# EAGLE design netzteil (EAGLE 9.2.2)
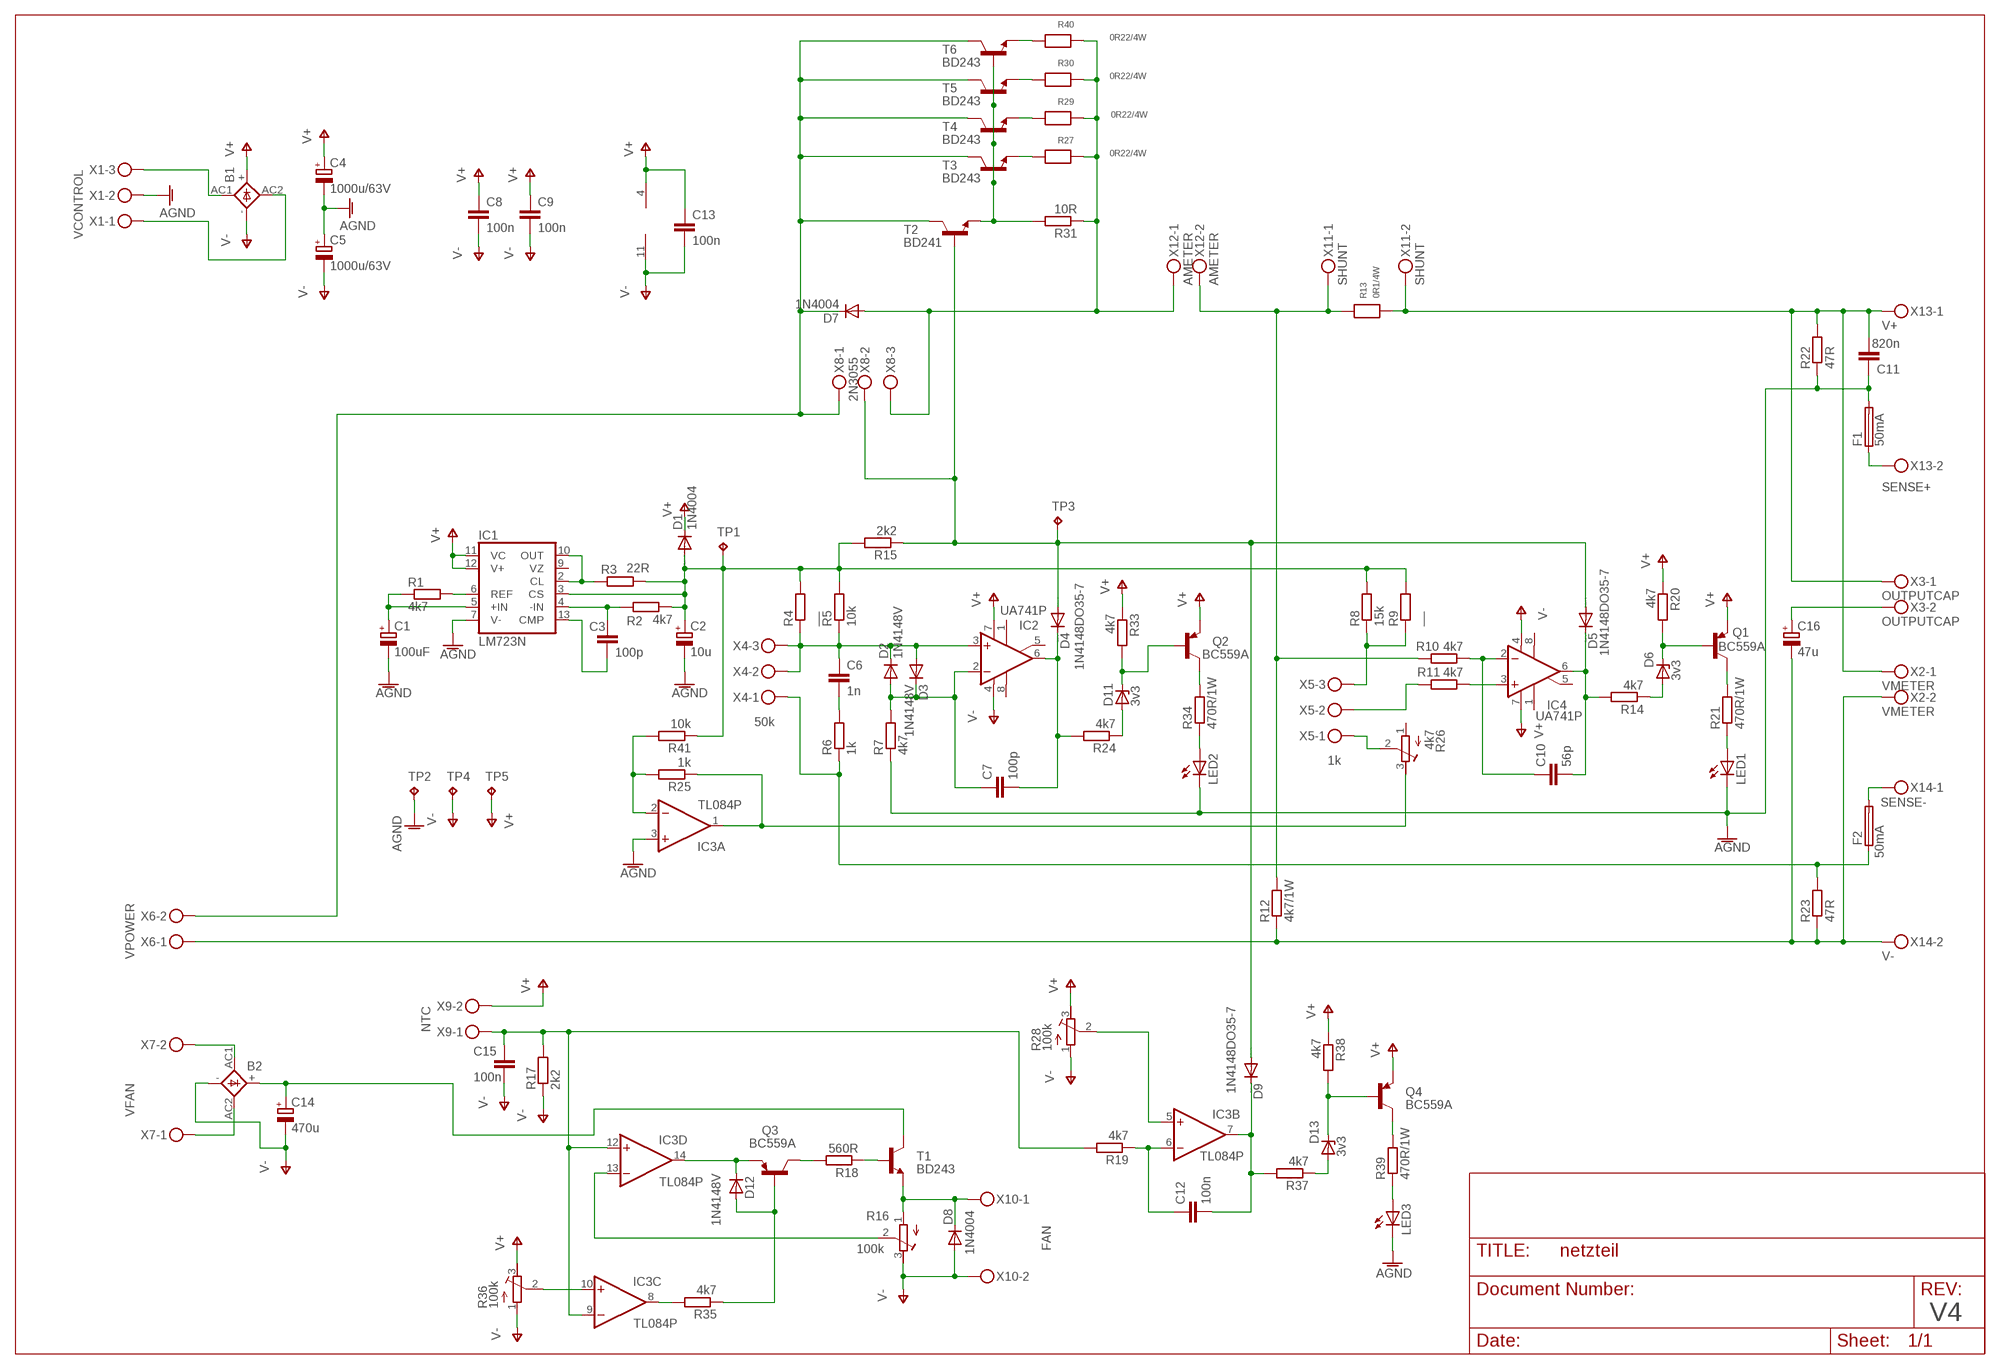
[diagram p0: schematic, sheet 1]

## Parts
B1  1KAB  [1KAB]
B2  1KAB  [1KAB]
C1  100uF  CPOL-EUE3.5-8  [E3,5-8]
C2  10u  CPOL-EUE3.5-8  [E3,5-8]
C3  100p  C-EU025-025X050  [C025-025X050]
C4  1000u/63V  CPOL-EUE7.5-18  [E7,5-18]
C5  1000u/63V  CPOL-EUE7.5-18  [E7,5-18]
C6  1n  C-EU025-025X050  [C025-025X050]
C7  100p  C-EU025-025X050  [C025-025X050]
C8  100n  C-EU025-025X050  [C025-025X050]
C9  100n  C-EU025-025X050  [C025-025X050]
C10  56p  C-EU025-025X050  [C025-025X050]
C11  820n  C-EU025-025X050  [C025-025X050]
C12  100n  C-EU025-025X050  [C025-025X050]
C13  100n  C-EU025-025X050  [C025-025X050]
C14  470u  CPOL-EUE5-13  [E5-13]
C15  100n  C-EU025-025X050  [C025-025X050]
C16  47u  CPOL-EUE3.5-8  [E3,5-8]
D1  1N4004  [DO41-10]
D2  1N4148V  [SHORTDIODE]
D3  1N4148V  [SHORTDIODE]
D4  1N4148DO35-7  [DO35-7]
D5  1N4148DO35-7  [DO35-7]
D6  3v3  ZENER-DIODE  [SHORTDIODE]
D7  1N4004  [DO41-10]
D8  1N4004  [DO41-10]
D9  1N4148DO35-7  [DO35-7]
D11  3v3  ZENER-DIODE  [SHORTDIODE]
D12  1N4148V  [SHORTDIODE]
D13  3v3  ZENER-DIODE  [SHORTDIODE]
F1  50mA  FUSEPICOFUSE  [PICOFUSE]
F2  50mA  FUSEPICOFUSE  [PICOFUSE]
IC1  LM723N  [DIL14]
IC2  UA741P  [DIL08]
IC3  TL084P  [DIL14]
IC4  UA741P  [DIL08]
LED1  LED3MM  [LED3MM]
LED2  LED3MM  [LED3MM]
LED3  LED3MM  [LED3MM]
Q1  BC559A  [TO92-EBC]
Q2  BC559A  [TO92-EBC]
Q3  BC559A  [TO92-EBC]
Q4  BC559A  [TO92-EBC]
R1  4k7  R-EU_0207/2V  [0207/2V]
R2  4k7  R-EU_0207/2V  [0207/2V]
R3  22R  R-EU_0207/2V  [0207/2V]
R4  __  R-EU_0207/2V  [0207/2V]
R5  10k  R-EU_0207/2V  [0207/2V]
R6  1k  R-EU_0207/2V  [0207/2V]
R7  4k7  R-EU_0207/2V  [0207/2V]
R8  15k  R-EU_0207/2V  [0207/2V]
R9  __  R-EU_0207/2V  [0207/2V]
R10  4k7  R-EU_0207/2V  [0207/2V]
R11  4k7  R-EU_0207/2V  [0207/2V]
R12  4k7/1W  R-EU_0207/10  [0207/10]
R13  0R1/4W  R  [4W_RM15]
R14  4k7  R-EU_0207/2V  [0207/2V]
R15  2k2  R-EU_0207/7  [0207/7]
R16  100k  R-TRIMM3296Y  [RTRIM3296Y]
R17  2k2  R-EU_0207/2V  [0207/2V]
R18  560R  R-EU_0207/2V  [0207/2V]
R19  4k7  R-EU_0207/7  [0207/7]
R20  4k7  R-EU_0207/2V  [0207/2V]
R21  470R/1W  R-EU_0207/2V  [0207/2V]
R22  47R  R-EU_0207/2V  [0207/2V]
R23  47R  R-EU_0207/2V  [0207/2V]
R24  4k7  R-EU_0207/2V  [0207/2V]
R25  1k  R-EU_0207/2V  [0207/2V]
R26  4k7  R-TRIMM3296Y  [RTRIM3296Y]
R27  0R22/4W  R  [4W_RM15]
R28  100k  R-TRIMM3296Y  [RTRIM3296Y]
R29  0R22/4W  R  [4W_RM15]
R30  0R22/4W  R  [4W_RM15]
R31  10R  R-EU_0207/2V  [0207/2V]
R33  4k7  R-EU_0207/2V  [0207/2V]
R34  470R/1W  R-EU_0207/2V  [0207/2V]
R35  4k7  R-EU_0207/2V  [0207/2V]
R36  100k  R-TRIMM3296Y  [RTRIM3296Y]
R37  4k7  R-EU_0207/2V  [0207/2V]
R38  4k7  R-EU_0207/2V  [0207/2V]
R39  470R/1W  R-EU_0207/2V  [0207/2V]
R40  0R22/4W  R  [4W_RM15]
R41  10k  R-EU_0207/2V  [0207/2V]
T1  BD243  -NPN-TO220V  [TO220V]
T2  BD241  -NPN-TO220V  [TO220V]
T3  BD243  -NPN-TO220V  [TO220V]
T4  BD243  -NPN-TO220V  [TO220V]
T5  BD243  -NPN-TO220V  [TO220V]
T6  BD243  -NPN-TO220V  [TO220V]
TP1  TPPAD1-13  [P1-13]
TP2  TPPAD1-13  [P1-13]
TP3  TPPAD1-13  [P1-13]
TP4  TPPAD1-13  [P1-13]
TP5  TPPAD1-13  [P1-13]
X1  VCONTROL  MKDSN1,5/3-5,08  [MKDSN1,5/3-5,08]
X2  VMETER  MKDSN1,5/2-5,08  [MKDSN1,5/2-5,08]
X3  OUTPUTCAP  MKDSN1,5/2-5,08  [MKDSN1,5/2-5,08]
X4  50k  MKDSN1,5/3-5,08  [MKDSN1,5/3-5,08]
X5  1k  MKDSN1,5/3-5,08  [MKDSN1,5/3-5,08]
X6  VPOWER  MKDSN1,5/2-5,08  [MKDSN1,5/2-5,08]
X7  VFAN  MKDSN1,5/2-5,08  [MKDSN1,5/2-5,08]
X8  2N3055  MKDSN1,5/3-5,08  [MKDSN1,5/3-5,08]
X9  NTC  MKDSN1,5/2-5,08  [MKDSN1,5/2-5,08]
X10  FAN  MKDSN1,5/2-5,08  [MKDSN1,5/2-5,08]
X11  SHUNT  MKDSN1,5/2-5,08  [MKDSN1,5/2-5,08]
X12  AMETER  MKDSN1,5/2-5,08  [MKDSN1,5/2-5,08]
X13  V+  MKDSN1,5/2-5,08  [MKDSN1,5/2-5,08]
X14  V-  MKDSN1,5/2-5,08  [MKDSN1,5/2-5,08]

## Nets
AGND: C1.- C2.- C4.- C5.+ C11.1 F1.2 IC1.7(V-) IC3.3(A:+IN) LED1.K(C) LED2.K(C) LED3.K(C) R7.1 R22.1 TP2.TP X1.2
N$1: IC1.6(REF) R1.2
N$2: C1.+ IC1.5(+IN) R1.1
N$3: C6.1 D2.K(C) D3.A IC2.3(+IN) R4.1 R5.1 X4.2 X4.3
N$4: C6.2 R6.2
N$5: C3.1 IC1.4(-IN) R2.1
N$6: IC1.2(CL) IC1.10(OUT) R3.1
N$7: IC3.2(A:-IN) R25.2 R41.2
N$8: C7.1 D2.A D3.K(C) IC2.2(-IN) R7.2
N$9: C3.2 IC1.13(CMP)
N$10: C7.2 D4.C IC2.6(OUT) R24.2
N$11: C10.1 IC4.2(-IN) R10.1
N$12: IC4.3(+IN) R11.1
N$13: R8.1 R9.1 X5.3
N$14: R11.2 X5.2
N$15: D4.A D5.A D9.A R15.1 T2.1(B) TP3.TP X8.2
N$16: C10.2 D5.C IC4.6(OUT) R14.2
N$17: R10.2 R12.2 R13.P$1 X11.1 X12.2
N$18: C11.2 R13.P$2 R22.2 X2.1 X3.1 X11.2 X13.1
N$19: D7.A R27.P$2 R29.P$2 R30.P$2 R31.1 R40.P$2 X8.3 X12.1
N$20: D6.K(C) Q1.B R20.2
N$21: D11.K(C) Q2.B R33.2
N$22: D11.A R24.1
N$23: B1.AC1 X1.3
N$24: B1.AC2 X1.1
N$25: Q2.C R34.2
N$26: D6.A R14.1
N$27: Q1.C R21.2
N$28: LED1.A R21.1
N$29: D7.C T2.2(C) T3.2(C) T4.2(C) T5.2(C) T6.2(C) X6.2 X8.1
N$30: F2.1 R6.1 R23.2 X4.1
N$31: C16.- R12.1 R23.1 X2.2 X6.1 X14.2
N$32: R26.2(S) X5.1
N$33: IC3.1(A:OUT) R25.1 R26.3(E)
N$34: LED2.A R34.1
N$35: C16.+ X3.2
N$36: D12.K(C) IC3.14(D:OUT) Q3.E
N$37: Q3.C R18.2
N$38: D12.A Q3.B R35.1
N$39: IC3.8(C:OUT) R35.2
N$40: IC3.10(C:+IN) R36.2(S)
N$41: IC3.13(D:-IN) R16.2(S)
N$42: C12.1 IC3.6(B:-IN) R19.1
N$43: F2.2 X14.1
N$44: R18.1 T1.1(B)
N$45: IC3.5(B:+IN) R28.2(S)
N$46: D8.C R16.1(A) T1.3(E) X10.1
N$47: C12.2 D9.C IC3.7(B:OUT) R37.2
N$48: C15.1 IC3.9(C:-IN) IC3.12(D:+IN) R17.2 R19.2 X9.1
N$49: R31.2 T2.3(E) T3.1(B) T4.1(B) T5.1(B) T6.1(B)
N$50: R27.P$1 T3.3(E)
N$51: R29.P$1 T4.3(E)
N$52: R30.P$1 T5.3(E)
N$53: B2.AC1 X7.2
N$54: B2.AC2 X7.1
N$55: B2.+ C14.+ T1.2(C)
N$56: D13.K(C) Q4.B R38.2
N$57: D13.A R37.1
N$58: Q4.C R39.2
N$59: LED3.A R39.1
N$60: F1.1 X13.2
N$63: R40.P$1 T6.3(E)
V723: C2.+ D1.A IC1.3(CS) R2.2 R3.2 R4.2 R5.2 R8.2 R9.2 R15.2 R41.1 TP1.TP
V+: B1.+ C4.+ C8.1 C9.1 C13.1 D1.C IC1.11(VC) IC1.12(V+) IC2.7(V+) IC3.4(P:V+) IC4.7(V+) Q1.E Q2.E Q4.E R20.1 R28.3(E) R33.1 R36.3(E) R38.1 TP5.TP X9.2
V-: B1.- B2.- C5.- C8.2 C9.2 C13.2 C14.- C15.2 D8.A IC2.4(V-) IC3.11(P:V-) IC4.4(V-) R16.3(E) R17.1 R28.1(A) R36.1(A) TP4.TP X10.2
Unconnected: IC1.9(VZ) IC2.1(ON1) IC2.5(ON2) IC2.8(OPT) IC4.1(ON1) IC4.5(ON2) IC4.8(OPT) R26.1(A)

## Notes on the sheet
- SENSE+
- SENSE-
- V4

## Library data of the parts
B1 B2 = rectifier:1KAB: RECTIFIER grid 5,08 x 5,08 mm
C1 C2 C4 C5 C14 C16 = rcl:CPOL-EU: POLARIZED CAPACITOR, European symbol; SPICEPREFIX: C
C3 C6-C13 C15 = rcl:C-EU: CAPACITOR, European symbol; SPICEPREFIX: C
D1 = diode:1N4004: DIODE
D2-D5 D9 D12 = diode:1N4148: DIODE high speed (Philips)
D6 D11 D13 = diode:ZENER-DIODE: Z-Diode
D7 D8 = adafruit:1N4004: DIODE
F1 F2 = fuse:FUSE: Fuse; OC_FARNELL: unknown; OC_NEWARK: unknown
IC1 = linear:*723: Positive VOLTAGE REGULATOR
IC2 IC4 = linear:*741: OP AMP
IC3 = linear:TL084: OP AMP
LED1-LED3 = adafruit:LED: LED OSRAM: - CHIPLED LG R971, LG N971, LY N971, LG Q971, LY Q971, LO R971, LY R971 LH N974, LH R974 LS Q976, LO Q976, LY Q976 LO Q996 - Hyper CHIPLED LW Q18S LB Q993, LB Q99A, LB R99A - SideLED LS A670, LO A670, LY A670, LG A670, LP A670 LB A673, LV A673, LT A673, LW A673 LH A674 LY A675 LS A676, LA A676, LO A676, LY A676, LW A676 LS A679, LY A679, LG A679 - Hyper Micro SIDELED® LS Y876, LA Y876, LO Y876, LY Y876 LT Y87S - SmartLED LW L88C, LW L88S LB L89C, LB L89S, LG L890 LS L89K, LO L89K, LY L89K LS L896, LA L896, LO L896, LY L896 - TOPLED LS T670, LO T670, LY T670, LG T670, LP T670 LSG T670, LSP T670, LSY T670, LOP T670, LYG T670 LG T671, LOG T671, LSG T671 LB T673, LV T673, LT T673, LW T673 LH T674 LS T676, LA T676, LO T676, LY T676, LB T676, LH T676, LSB T676, LW T676 LB T67C, LV T67C, LT T67C, LS T67K, LO T67K, LY T67K, LW E67C LS E67B, LA E67B, LO E67B, LY E67B, LB E67C, LV E67C, LT E67C LW T67C LS T679, LY T679, LG T679 LS T770, LO T770, LY T770, LG T770, LP T770 LB T773, LV T773, LT T773, LW T773 LH T774 LS E675, LA E675, LY E675, LS T675 LS T776, LA T776, LO T776, LY T776, LB T776 LHGB T686 LT T68C, LB T68C - Hyper Mini TOPLED® LB M676 - Mini TOPLED Santana® LG M470 LS M47K, LO M47K, LY M47K Source: http://www.osram.convergy.de/
Q1-Q4 = transistor-pnp:BC559*: PNP Transistror
R1-R12 R14 R15 R17-R25 R31 R33-R35 R37-R39 R41 = rcl:R-EU_: RESISTOR, European symbol; SPICEPREFIX: R
R13 R27 R29 R30 R40 = powerR:R: resistor
R16 R26 R28 R36 = rcl:R-TRIMM: Trimm resistor; SPICEMODEL: X; SPICEPREFIXL: POT
T1-T6 = transistor:*-NPN-: NPN Transistror BF959 corrected 2008.03.06
TP1-TP5 = testpad:TP: Test pad
X1 X4 X5 X8 = con-phoenix-508:MKDSN1,5/3-5,08: MKDSN 1,5/ 3-5,08 Printklemme Nennstrom: 13,5 A Nennspannung: 250 V Rastermaß: 5,08 mm Polzahl: 3 Anschlussart: Schraubanschluss Montage: Löten Anschlussrichtung Leiter/Platine: 0 ° Artikelnummer: 1729131 Source: http://eshop.phoenixcontact.com .. 1729131.pdf
X2 X3 X6 X7 X9-X14 = con-phoenix-508:MKDSN1,5/2-5,08: MKDSN 1,5/ 2-5,08 Printklemme Nennstrom: 13,5 A Nennspannung: 250 V Rastermaß: 5,08 mm Polzahl: 2 Anschlussart: Schraubanschluss Montage: Löten Anschlussrichtung Leiter/Platine: 0 ° Artikelnummer: 1729128 Source: http://eshop.phoenixcontact.com .. 1729128.pdf

## Board
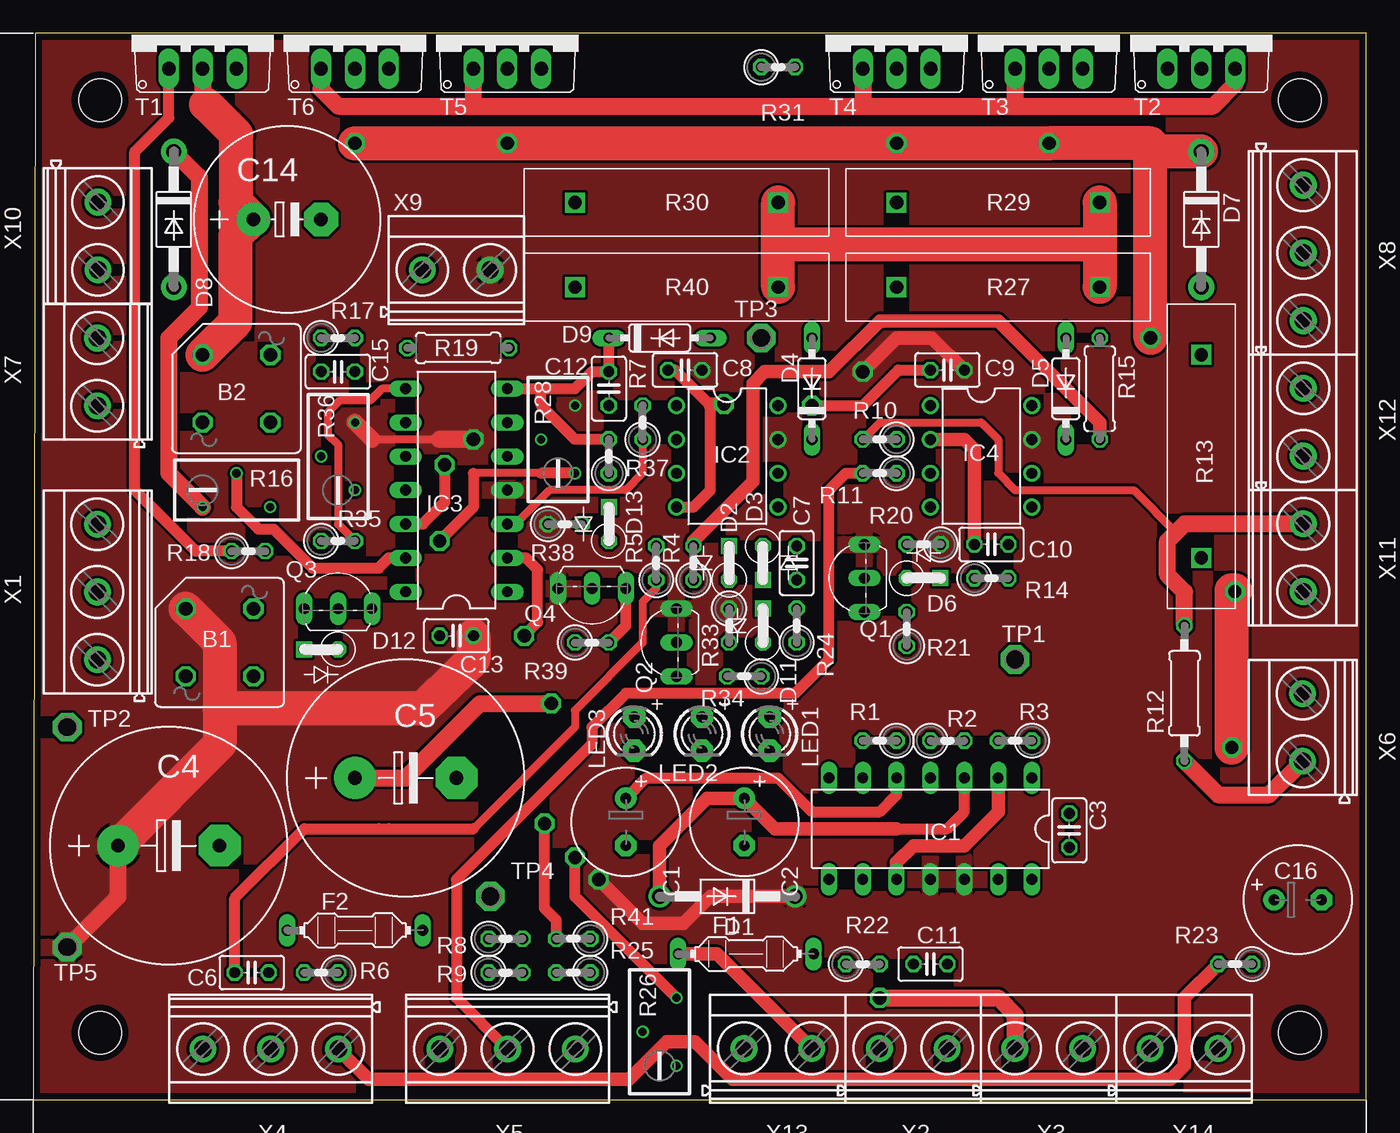
[diagram p1: board, top side]
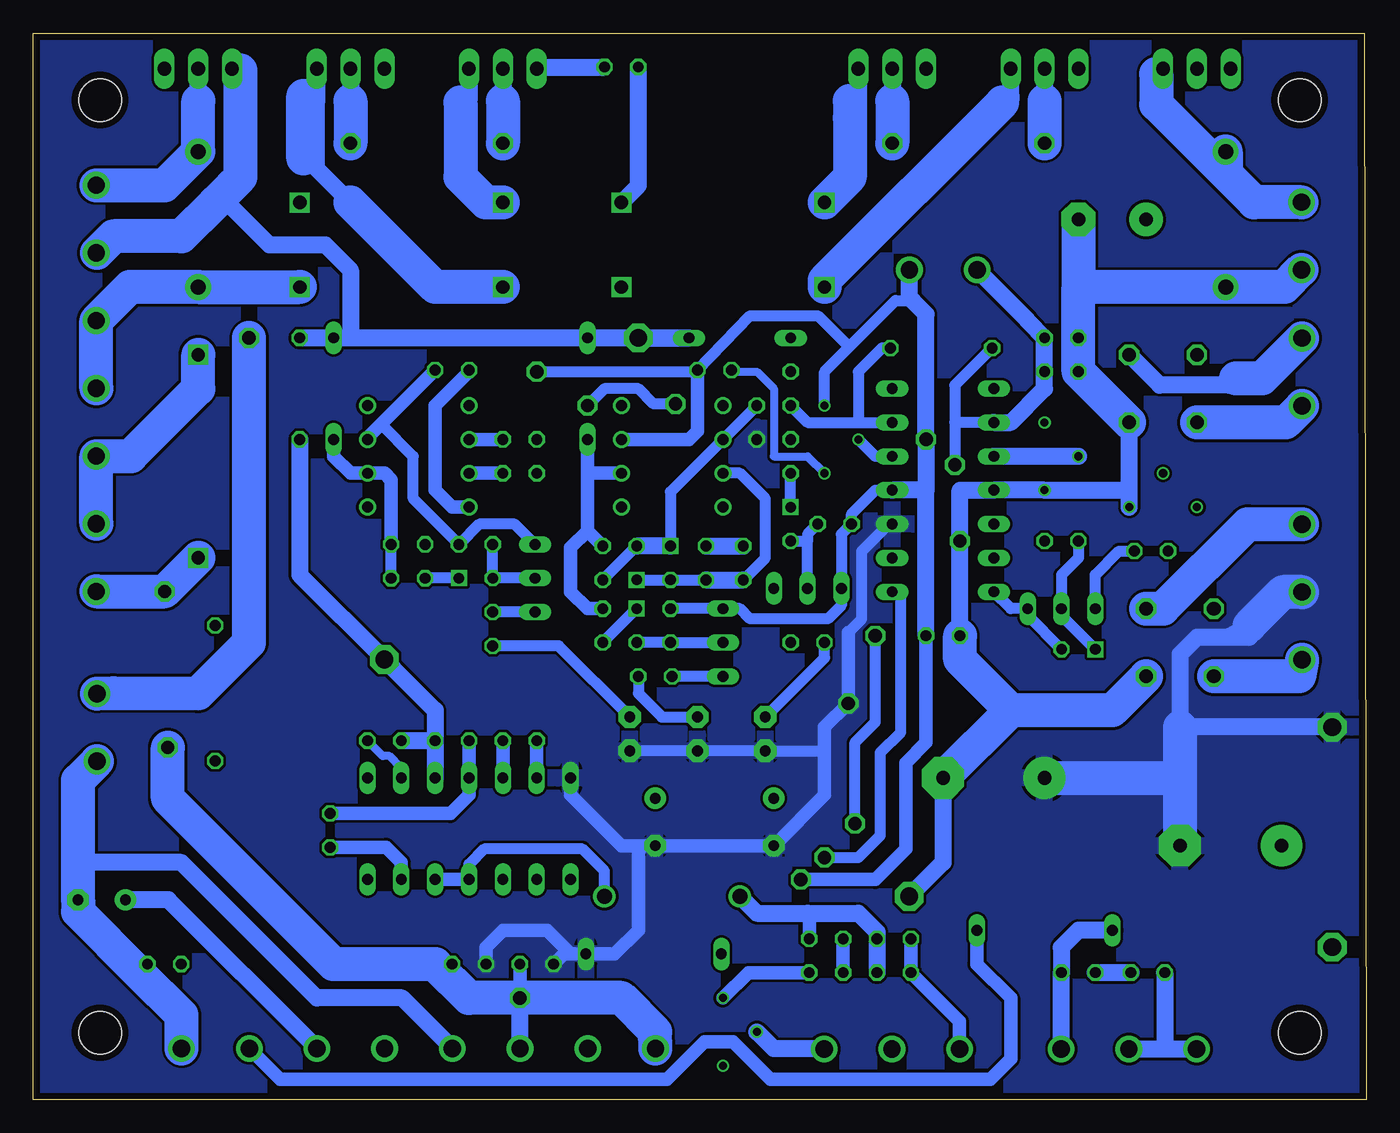
[diagram p2: board, bottom side, seen from below]

Size 100 x 80 mm. Coordinates in mm from the lower left corner, seen from the top.
Outline: 0,0 100,0 100,80 0.13,80 0,0
Copper layers (1*16): Top 0.035mm / dielectric 1.6mm / Bottom 0.035mm
Design rules "Elecrow_2-layer_PCB_eagle_rule *": minimum track width 6mil, minimum drill 12mil, track to track 8mil, track to pad 8mil, pad to pad 8mil, via to via 8mil, smd to smd 0mil, copper to edge 20mil, drill to drill 10mil, minimum pad ring 6mil, minimum via ring 6mil, stop-mask expansion 0mil, vias tented up to drill 100mil, thermal gap 10mil
Holes 3.2 mm at 5,5 5,75 95,75 95,5

### Footprints (pad centres in the part's own frame; a part is rotated, then mirrored left to right if it is on the bottom)
1KAB = drill 1.016 octagon: + 2.54,-2.54; - -2.54,2.54; AC1 -2.54,-2.54; AC2 2.54,2.54
E3,5-8 = drill 0.813 pad 1.6: + -1.778,0 | drill 0.813 pad 1.6 octagon: - 1.778,0
C025-025X050 = drill 0.813 octagon: 1 -1.27,0; 2 1.27,0
E7,5-18 = drill 1.016 pad 3.15: + -3.81,0 | drill 1.016 pad 3.15 octagon: - 3.81,0
E5-13 = drill 1.016 pad 2.54: + -2.54,0 | drill 1.016 pad 2.54 octagon: - 2.54,0
DO41-10 = drill 1.118: A 5.08,0; C -5.08,0
SHORTDIODE = drill 0.8 square: A -1.27,0 | drill 0.8 octagon: K 1.27,0
DO35-7 = drill 0.813 long: A 3.81,0; C -3.81,0
DO41-10' = drill 1.118 pad 1.93: A 5.08,0; C -5.08,0
PICOFUSE = drill 0.813 long: 1 -5.08,0; 2 5.08,0
DIL14 = drill 0.813 long: 1 -7.62,-3.81; 2 -5.08,-3.81; 3 -2.54,-3.81; 4 0,-3.81; 5 2.54,-3.81; 6 5.08,-3.81; 7 7.62,-3.81; 8 7.62,3.81; 9 5.08,3.81; 10 2.54,3.81; 11 0,3.81; 12 -2.54,3.81; 13 -5.08,3.81; 14 -7.62,3.81
DIL08 = drill 0.813 pad 1.27: 1 -3.81,-3.81; 2 -1.27,-3.81; 3 1.27,-3.81; 4 3.81,-3.81; 5 3.81,3.81; 6 1.27,3.81; 7 -1.27,3.81; 8 -3.81,3.81
LED3MM = drill 0.813 pad 1.676 octagon: A -1.27,0; K 1.27,0
TO92-EBC = drill 0.813 long: B 0,-1.27; C -2.54,-1.27; E 2.54,-1.27
0207/2V = drill 0.813 octagon: 1 -1.27,0; 2 1.27,0
0207/10 = drill 0.813 octagon: 1 -5.08,0; 2 5.08,0
4W_RM15 = drill 1 square: P$1 -7.62,0; P$2 7.62,0
0207/7 = drill 0.813 octagon: 1 -3.81,0; 2 3.81,0
RTRIM3296Y = drill 0.61: 1 1.27,-2.54; 2 -1.27,0; 3 1.27,2.54
TO220V = drill 1.016 long: 1 -2.54,-2.54; 2 0,-2.54; 3 2.54,-2.54
P1-13 = drill 1.321 pad 2.159 octagon: TP 0,0
MKDSN1,5/3-5,08 = drill 1.3 pad 2: 1 -7.641,0.025; 2 -2.561,0.025; 3 2.519,0.025
MKDSN1,5/2-5,08 = drill 1.3 pad 2: 1 -2.561,0.025; 2 2.519,0.025

### Placement (x,y rotation side)
B1  13.97,34.29 180 top
B2  15.24,53.34 180 top
C1  44.45,20.83 270 top
C2  53.34,20.83 270 top
C3  77.72,20.19 270 top
C4  10.16,19.05 0 top
C5  27.94,24.13 0 top
C6  16.38,9.53 0 top
C7  57.28,40.26 90 top
C8  48.9,54.74 180 top
C9  68.58,54.74 180 top
C10  71.88,41.66 0 top
C11  67.31,10.16 0 top
C12  43.18,53.34 90 top
C13  31.75,34.8 180 top
C14  19.05,66.04 0 top
C15  22.86,54.61 180 top
C16  94.87,14.99 0 top
D1  52.07,15.24 180 top
D2  52.2,40.26 270 top
D3  54.74,40.26 90 top
D4  58.42,53.34 90 top
D5  77.47,53.34 90 top
D6  66.8,39.12 180 top
D7  1N4004  [DO41-10']  87.63,66.04 270 top
D8  1N4004  [DO41-10']  10.54,66.04 270 top
D9  46.99,57.15 0 top
D11  54.74,35.56 270 top
D12  21.59,33.78 0 top
D13  43.18,43.18 270 top
F1  53.47,10.92 0 top
F2  24.13,12.7 0 top
IC1  67.31,20.32 180 top
IC2  52.07,48.26 270 top
IC3  31.75,45.72 90 top
IC4  71.12,48.26 270 top
LED1  55.24,27.43 270 top
LED2  50.16,27.43 270 top
LED3  45.09,27.43 270 top
Q1  61.09,39.12 90 top
Q2  46.99,34.29 90 top
Q3  22.86,38.1 0 top
Q4  41.91,37.08 180 top
R1  63.5,26.92 180 top
R2  68.58,26.92 0 top
R3  73.66,26.92 180 top
R4  49.53,40.26 90 top
R5  46.74,40.26 90 top
R6  21.59,9.53 180 top
R7  45.72,50.8 90 top
R8  35.43,12.06 0 top
R9  35.43,9.53 0 top
R10  63.5,49.53 180 top
R11  63.5,46.99 180 top
R12  86.36,30.48 90 top
R13  87.63,48.26 270 top
R14  71.88,39.12 0 top
R15  80.01,53.34 270 top
R16  15.24,45.72 270 top
R17  22.86,57.15 0 top
R18  16.13,41.15 0 top
R19  31.88,56.39 180 top
R20  66.8,41.66 180 top
R21  65.53,35.31 90 top
R22  62.23,10.16 0 top
R23  90.17,10.16 180 top
R24  57.28,35.56 90 top
R25  40.51,9.53 180 top
R26  46.99,5.08 0 top
R27  72.39,60.96 0 top
R28  39.37,49.53 0 top
R29  72.39,67.31 0 top
R30  48.26,67.31 0 top
R31  55.88,77.47 0 top
R33  52.2,35.56 270 top
R34  53.34,31.75 180 top
R35  22.86,41.91 0 top
R36  22.86,48.26 0 top
R37  43.18,48.26 90 top
R38  39.88,43.18 0 top
R39  41.91,34.29 0 top
R40  48.26,60.96 0 top
R41  40.51,12.06 180 top
T1  12.7,79.88 0 top
T2  87.63,79.88 0 top
T3  76.2,79.88 0 top
T4  64.77,79.88 0 top
T5  35.56,79.88 0 top
T6  24.13,79.88 0 top
TP1  73.66,33.02 0 top
TP2  2.54,27.94 0 top
TP3  54.61,57.15 0 top
TP4  34.29,15.24 0 top
TP5  2.54,11.43 0 top
X1  4.83,40.64 90 top
X2  66.04,3.81 0 top
X3  76.2,3.81 0 top
X4  15.24,3.81 180 top
X5  33.02,3.81 180 top
X6  95.25,27.94 90 top
X7  4.83,54.61 90 top
X8  95.25,60.96 270 top
X9  31.75,62.23 0 top
X10  4.83,64.77 270 top
X11  95.25,40.64 270 top
X12  95.25,50.8 270 top
X13  55.88,3.81 0 top
X14  86.36,3.81 0 top

### Tracks (layer width: path | path; a pad name or v marks a point on that pad's centre or on a via)
AGND  (via drill 1)
  Top 0.61: R7.1 45.72,46.99 44.45,45.72 38.73,45.72 36.07,43.05 35.69,43.05 35.69,43.18 IC3.3
  Top 1.27: C5.+ 27.94,24.13 33.53,29.72 v38.86,29.72
  Bottom 0.61: IC3.3 35.81,43.18
  Bottom 0.813: 38.86,35.05 37.85,36.07 37.85,41.15 35.81,43.18 | 40.64,26.16 LED3.K LED2.K LED1.K
  Bottom 1.016: 54.61,19.05 C2.- C1.- 40.64,22.86 40.64,26.16 40.64,27.94 v38.86,29.72 38.86,35.05 | 54.61,19.05 55.88,19.05 59.69,22.86 IC1.7 | C11.1 66.04,11.43 64.77,12.7 61.47,12.7 59.69,10.92 | 54.61,19.05 54.61,12.7 56.39,10.92 F1.2 59.69,10.92 | 59.69,10.92 60.2,10.92 R22.1
  Bottom 1.27: 8.76,35.56 10.16,34.8 8.76,34.67 12.7,34.67 13.97,33.4 13.97,27.94 TP2.TP
  Bottom 2.54: X1.2 6.24,38.08 8.76,35.56 | 13.97,27.94 13.97,24.13 | 13.97,24.13 C4.- | C5.+ 13.97,24.13
  pour Bottom: 0,0 100.33,0 100.33,80.01 0,80.01
N$1
  Bottom 1.016: IC1.6 R1.2
N$2
  Top 0.813: C1.+ 45.97,24.13 55.88,24.13 58.42,21.59 63.5,21.59 64.77,22.86 IC1.5
  Bottom 1.016: IC1.5 R1.1
N$3
  Top 0.61: R5.1 46.74,38.35 45.72,37.34 45.72,34.29 40.64,29.21 40.64,27.94 33.02,20.32
  Top 0.813: 33.02,20.32 26.67,20.32 25.91,20.32 20.32,20.32 15.11,15.11 C6.1
  Bottom 0.813: D3.A D2.K R4.1 | R5.1 45.09,40.64 45.09,45.09 46.99,46.99 IC2.3
  Bottom 1.27: X4.3 15.24,3.79 | 15.24,3.79 X4.2 | C6.1 15.11,3.91 15.24,3.79 | R4.1 R5.1
N$4
  Bottom 1.27: C6.2 R6.2
N$5
  Bottom 1.016: R2.1 IC1.4 67.31,22.86 68.71,21.46 C3.1
N$6
  Top 1.016: IC1.10 64.77,17.78 66.04,19.05 69.85,19.05 72.39,21.59 IC1.2
  Bottom 0.61: IC1.2 72.39,24.89 73.28,25.78 73.79,25.78 R3.1
N$7  (via drill 1)
  Top 0.813: R41.2 39.24,13.46 38.35,14.35 v38.35,20.7 | v36.83,34.8 37.85,35.81 37.85,39.75 36.96,40.64 IC3.2
  Bottom 0.813: v38.35,20.7 38.35,26.8 36.83,28.32 v36.83,34.8
  Bottom 1.016: R25.2 R41.2
N$8
  Bottom 0.813: R7.2 IC2.2 52.2,45.59 D2.A | C7.1 D3.K
  Bottom 1.27: D2.A D3.K
N$9
  Bottom 1.016: C3.2 73.53,18.92 72.39,17.78 IC1.13
N$10
  Bottom 1.016: C7.2 58.42,42.67 | 58.42,42.67 58.42,46.99 | 58.42,46.99 D4.C | IC2.6 58.42,46.99 | R24.2 58.42,36.83 59.69,38.1 59.69,41.4 58.42,42.67
N$11
  Top 1.016: C10.1 70.61,48.77 69.85,49.53 IC4.2
  Bottom 1.016: IC4.2 R10.1
N$12
  Bottom 1.016: IC4.3 R11.1
N$13
  Bottom 1.016: R8.1 R9.1 30.5,5.86 X5.3
N$14
  Top 0.813: R11.2 60.96,46.99 59.69,45.72 59.69,33.02 57.15,30.48 44.45,30.48 41.91,27.94 41.91,26.67 31.75,16.51 31.75,7.62 X5.2
N$15
  Bottom 0.813: D4.A 59.69,57.15
  Bottom 1.016: D5.A 76.2,57.15
  Bottom 1.27: T2.1 85.09,68.58 | 95.23,63.52 X8.2 | 76.2,57.15 59.69,57.15 D9.A TP3.TP | 76.2,57.15 R15.1 | 86.36,67.31 85.47,67.31 82.3,64.14 78.11,64.14 76.2,62.23 76.2,57.15
  Bottom 2.54: 95.23,63.52 93.98,64.77 88.9,64.77 86.36,67.31 85.09,68.58 84.45,69.22 84.45,77.22
N$16
  Bottom 0.813: R14.2 C10.2
  Bottom 1.016: C10.2 73.15,46.48 73.66,46.99 IC4.6 76.2,46.99 77.47,48.26 D5.C
N$17
  Top 0.61: R10.2 63.5,50.8 71.12,50.8 72.39,49.53 72.39,46.99 73.66,45.72 82.55,45.72 85.72,42.55
  Top 1.27: R12.2 86.36,38.1 85.09,39.37 85.09,41.91 85.72,42.55 86.38,43.2 X11.1
  Bottom 2.54: X11.1 X12.2 92.69,48.28 87.63,53.34 R13.P$1
N$18  (via drill 1)
  Top 1.27: v63.5,7.62 72.39,7.62 73.66,6.35 73.64,6.33 X3.1
  Top 2.54: v89.92,26.42 89.92,38.23 90.15,38.23 v90.15,38.12
  Bottom 1.016: R22.2 v63.5,7.62 | C11.2 69.85,10.16
  Bottom 1.27: X2.1 63.5,3.86 v63.5,7.62
  Bottom 2.54: X11.2 v90.15,38.12 R13.P$2 | X13.1 53.34,5.08 55.88,7.62 v63.5,7.62 67.31,7.62 69.85,10.16 77.47,10.16 89.92,22.61 v89.92,26.42
N$19
  Top 2.54: R40.P$2 55.88,64.14 | 55.88,64.14 R30.P$2 | R29.P$2 80.01,64.14 | 80.01,64.14 R27.P$2 | 80.01,64.14 55.88,64.14
  Bottom 1.27: R30.P$2 54.61,68.58 R31.1
  Bottom 2.54: R27.P$2 D7.A 92.76,60.96 X8.3 X12.1
N$20
  Bottom 0.813: R20.2 D6.K Q1.B
N$21
  Bottom 0.813: D11.K R33.2 Q2.B
N$22
  Bottom 0.813: D11.A R24.1
N$23
  Bottom 2.54: X1.3 8.91,43.16 | B1.AC1 15.24,36.83 8.91,43.16 | 8.89,43.18 8.91,43.16
N$24
  Bottom 2.54: X1.1 5.03,31.75 B1.AC2
N$25
  Bottom 0.813: Q2.C R34.2
N$26
  Bottom 0.813: D6.A R14.1
N$27
  Bottom 0.813: Q1.C R21.2
N$28
  Bottom 0.813: LED1.A 60.58,34.04 R21.1
N$29  (via drill 1)
  Top 2.54: v24.13,71.75 v35.56,71.75 v64.77,71.75 v76.2,71.75 83.82,71.75 83.82,71.12 | v83.82,57.15 83.82,71.12 | D7.C 83.82,71.12
  Bottom 1.27: 87.63,74.93 T2.2 | 24.13,76.2 T6.2 24.13,74.93 | T3.2 76.2,74.93 | T4.2 64.77,74.93 | T5.2 35.56,74.93
  Bottom 2.54: 35.56,74.93 v35.56,71.75 | 24.13,74.93 v24.13,71.75 | 76.2,74.93 v76.2,71.75 | 64.77,74.93 v64.77,71.75 | X6.2 94,30.5 87.63,30.48 83.82,34.29 v83.82,57.15 | X8.1 90.15,68.6 D7.C 87.63,74.93
N$30
  Top 1.016: X4.1 25.15,1.52 44.7,1.52 47.5,4.32 49.66,4.32 52.45,1.52 85.34,1.52 86.36,2.54 86.36,7.62 R23.2
  Bottom 1.27: X4.1 22.88,9.5 | 22.88,9.5 R6.1 | F2.1 21.59,12.7 22.88,11.41 22.88,9.5
N$31
  Top 1.27: R12.1 88.9,22.86 92.71,22.86 X6.1
  Bottom 1.016: R23.1 92.08,9.53
  Bottom 1.27: X2.2 72.34,7.62 78.74,7.62 88.9,17.78 96.65,17.78
  Bottom 2.54: X14.2 88.88,6.33 92.08,9.53 96.65,14.1 C16.- 96.65,17.78 96.65,23.96 X6.1
N$32
  Bottom 1.27: X5.1 40.69,3.81 44.45,3.81 R26.2
N$33  (via drill 1)
  Top 0.813: R26.3 40.64,15.24 v40.64,18.16
  Bottom 0.813: v40.64,18.16 38.1,18.16 36.45,19.81 36.45,26.04 34.92,27.56 34.92,38.1 IC3.1
  Bottom 1.016: R26.3 46.35,9.53 R25.1
N$34
  Bottom 0.813: R34.1 54.61,30.48 52.83,28.7 LED2.A
N$35
  Bottom 1.27: C16.+ 89.87,14.99 X3.2
N$36
  Bottom 0.813: IC3.14 26.67,36.83 Q3.E 25.4,36.32 D12.K
N$37
  Bottom 0.813: Q3.C 20.32,39.37 18.54,41.15 R18.2
N$38
  Bottom 0.813: R35.1 21.59,40.64 22.86,39.37 Q3.B 22.86,36.32 D12.A
N$39
  Top 0.61: R35.2 22.86,43.18 22.86,49.15 22.1,49.91 22.1,51.56 22.99,52.45 25.27,52.45 26.16,53.34 IC3.8
N$40
  Bottom 1.27: R36.2 IC3.10
N$41
  Top 0.813: IC3.13 26.67,40.64 25.91,39.88 20.95,39.88 18.03,42.8 16.89,42.8 15.24,44.45 R16.2
N$42
  Bottom 0.813: R19.1 36.32,56.39 38.1,54.61 38.1,50.8 | 38.1,50.8 IC3.6 | C12.1 41.91,50.8 38.1,50.8
N$43
  Bottom 1.016: F2.2 29.21,10.16 26.67,7.62 26.67,3.05 28.19,1.52 44.7,1.52 47.5,4.32 49.66,4.32 52.45,1.52 81.49,1.52 X14.1
N$44
  Top 0.813: R18.1 12.19,41.15 7.62,45.72 7.62,71.12 10.16,73.66 T1.1
N$45
  Bottom 0.813: IC3.5 36.83,48.26 R28.2
N$46
  Top 1.27: D8.C 12.45,69.22 12.45,59.44 10.16,57.15 10.16,46.99 R16.1
  Bottom 1.27: 15.24,76.2 T1.3 15.75,77.34 15.75,76.96
  Bottom 2.54: X10.1 8.4,67.33 10.54,69.47 | 15.75,76.96 15.75,74.68 10.54,69.47 | D8.C 10.54,69.47
N$47
  Top 0.813: IC3.7 38.1,53.34 | 38.1,53.34 40.64,53.34 41.91,54.61 C12.2 D9.C | R37.2 40.64,49.53 38.1,52.07 38.1,53.34
N$48  (via drill 1)
  Top 0.813: v30.86,47.62 30.86,44.83 29.21,43.18 IC3.12
  Bottom 0.813: R19.2 30.86,53.59 30.86,50.8 | 30.86,50.8 v30.86,47.62 | IC3.9 30.86,50.8
  Bottom 1.27: X9.1 27.94,61.01 25.39,58.43 25.39,58.41 R17.2 C15.1 24.13,53.34 26.67,50.8 IC3.9
N$49
  Top 1.27: T2.3 90.17,76.2 88.52,74.55 73.66,74.55 | 33.02,74.55 22.86,74.55 21.59,75.82 T6.1 | 33.02,74.55 62.23,74.55 | 62.23,74.55 73.66,74.55 | 33.02,74.55 T5.1 | T4.1 62.23,74.55 | T3.1 73.66,74.55
  Bottom 1.27: R31.2 61.98,77.47 61.98,77.34 T4.1
N$50
  Bottom 1.27: 76.2,67.31 78.74,69.85 78.74,74.93 | T3.3 78.74,74.93 | 79.76,75.31 78.74,74.93
  Bottom 2.54: R27.P$1 69.85,60.96 76.2,67.31 | 79.76,70.61 79.76,75.31
N$51
  Bottom 1.27: T4.3 67.31,74.93 67.94,74.8
  Bottom 2.54: R29.P$1 66.04,67.31 67.94,69.22 67.94,74.8
N$52
  Bottom 1.27: 38.1,74.93 38.73,74.93 | T5.3 38.1,73.66 38.73,73.66
  Bottom 2.54: 38.73,74.93 38.73,73.66 38.73,69.22 R30.P$1
N$53
  Bottom 1.27: B2.AC1 15.49,53.59 10.29,53.59 9.78,54.1
  Bottom 2.54: X7.2 7.83,54.1 9.78,54.1
N$54
  Bottom 2.54: X7.1 6.05,50.8 B2.AC2
N$55
  Top 1.27: T1.2 12.7,74.93 12.95,74.68
  Top 2.54: 15.16,64.85 C14.+ 15.24,67.31 15.16,67.31 | 12.95,74.68 15.24,72.39 15.16,72.31 15.16,67.31 | 15.16,67.31 15.16,64.85 | B2.+ 15.16,58.34 15.16,64.85
N$56
  Bottom 0.813: D13.K 41.91,41.91 | Q4.B 41.91,41.91 | R38.2 41.91,42.42 41.91,41.91
N$57
  Bottom 0.813: D13.A R37.1
N$58
  Top 0.813: R39.2 44.45,35.56 Q4.C
N$59
  Bottom 0.813: LED3.A 40.64,33.15 R39.1
N$60
  Top 1.016: X13.2 51.31,10.92 F1.1
N$63
  Bottom 1.27: 27.3,74.8 26.67,75.44 | 26.67,75.44 T6.3 | 26.67,75.44 26.67,74.93
  Bottom 2.54: 27.3,74.8 40.64,61.47 R40.P$1
V723
  Top 0.813: 64.77,20.32 68.58,20.32 69.85,21.59 IC1.3
  Top 1.016: 64.77,20.32 55.63,20.32 C2.+ 50.55,22.61 46.99,19.05 D1.A | R4.2 49.53,41.91 53.98,46.35 53.98,53.72 54.86,54.61 59.69,54.61 63.5,58.42 72.39,58.42 80.01,50.8 R15.2
  Bottom 1.016: IC1.3 69.85,26.67 | 69.85,26.67 R2.2 | R3.2 70.1,26.92 69.85,26.67 | R8.2 R9.2 | R41.1 41.78,13.84 41.91,13.97
  Bottom 1.27: R4.2 R5.2 | R15.2 80.01,39.37 TP1.TP 73.03,32.38 69.85,29.21 IC1.3 | R2.2 R3.2 | D1.A 45.72,13.97 41.91,13.97 38.1,13.97 36.7,12.57 R9.2
V+  (via drill 1)
  Top 0.61: 30.48,49.53 25.4,49.53
  Top 1.016: C9.1 67.44,57.15 64.77,57.15 v62.23,54.61 | v42.42,16.51 45.72,13.21 48.77,13.21 50.8,15.24 D1.C
  Top 1.27: R36.3 25.4,49.53 | v33.02,49.53 30.48,49.53 | TP5.TP 6.35,15.24 C4.+
  Top 2.54: B1.+ 13.97,34.29 13.97,29.34 | C13.1 33.02,33.02 29.21,29.34 13.97,29.34 | 13.97,29.34 13.97,26.67 C4.+
  Bottom 0.61: 38.86,56.52 38.73,56.52
  Bottom 0.813: R28.3 40.64,54.61 38.73,56.52 35.31,59.94 34.04,59.94 | IC3.4 36.83,45.72 38.61,43.94 R38.1 39.37,42.42 Q4.E 39.37,37.08 40.39,36.07 46.23,36.07 46.99,36.83 Q2.E R33.1 | IC1.11 67.31,17.65 66.17,18.8 58.8,18.8 57.15,17.14 D1.C | C8.1 46.23,58.8 41.15,58.8 38.86,56.52 | v62.23,54.61 50.29,54.61 | 73.91,50.67 71.5,48.26 71.5,45.09 R20.1 66.55,43.18 63.88,43.18 Q1.E
  Bottom 1.016: IC1.12 IC1.11 | 54.61,49.53 IC2.7 50.8,49.53 50.16,50.16 C8.1 50.29,54.61 | C9.1 73.91,50.67 74.93,49.66 IC4.7 | C13.1 33.02,26.8 34.54,25.27 34.54,18.8 36.83,16.51 v42.42,16.51
  Bottom 1.27: X9.2 34.27,60.18 34.04,59.94 33.02,58.93 v33.02,49.53 33.02,45.72 | C13.1 33.02,45.72 | 33.02,45.72 IC3.4
  pour Top: 0,0 100.33,0 100.33,80.01 0,80.01
V-  (via drill 1)
  Top 0.61: 38.1,46.99 33.02,46.99
  Top 0.813: R28.1 38.1,46.99 | 33.02,46.99 33.02,44.45 v30.48,41.91 | IC2.4 49.53,44.45 50.8,45.72 50.8,52.07 48.13,54.74 C8.2 | v58.42,52.07 62.23,52.07 64.9,54.74 C9.2
  Top 1.016: 50.8,52.07 50.93,52.2 v51.82,52.2
  Bottom 0.61: C8.2 47.5,54.61 45.72,54.61 44.45,53.34 44.45,48.26 41.91,48.26 R28.1
  Bottom 0.813: v51.82,52.2 53.47,52.2 54.61,53.34 57.15,53.34 v58.42,52.07
  Bottom 1.016: IC4.4 68.58,44.45 69.85,45.72 69.85,52.07 67.31,54.61 C9.2
  Bottom 1.27: C15.2 R17.1 | R16.3 17.78,45.72 | 17.78,45.72 B2.- | 17.78,45.72 R36.1 IC3.11 30.48,45.72 v30.48,41.91 C13.2 | C5.- 31.75,17.78 TP4.TP
  Bottom 2.54: X10.2 6.14,60.96 D8.A 21.59,60.96 | C14.- 21.59,60.96 | B2.- C15.2 21.59,60.96 | B1.- 19.05,29.21 26.67,29.21 | 26.67,29.21 30.48,33.02 C13.2 | 26.67,29.21 C5.-

### Text on the board
tParts: TP3 | TP1 | stonetronics | TP2 | TP5 | powerSupply | 12/12/18 | TP4
bText: -FAN+ | NTC | VAC / FAN | C / B / E | A.M.+ / A.M.- | Rshunt | ~15V / GND | ~15V | VPower+ | VPower- | VSen+ / V+ | V.M. | 50k VPoti | 1K IPoti | COUT | V - / VSen- | + | -